# EAGLE design humidity (EAGLE 4.16)
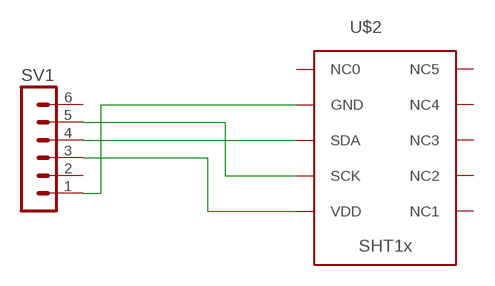
[diagram p0: schematic, sheet 1]

## Parts
SV1  MA06-1  [MA06-1]
U$2  SHT1X  [SHT1X]

## Nets
GND: SV1.1 U$2.P$2(GND)
SCK: SV1.5 U$2.P$4(SCK)
SDA: SV1.4 U$2.P$3(SDA)
VDD3_3: SV1.3 U$2.P$5(VDD)
Unconnected: SV1.2 SV1.6 U$2.P$1(NC0) U$2.P$6(NC1) U$2.P$7(NC2) U$2.P$8(NC3) U$2.P$9(NC4) U$2.P$10(NC5)

## Library data of the parts
SV1 = con-lstb:MA06-1: PIN HEADER
U$2 = Stofer:SHT1X: Sensiron Humidity sensor

## Board
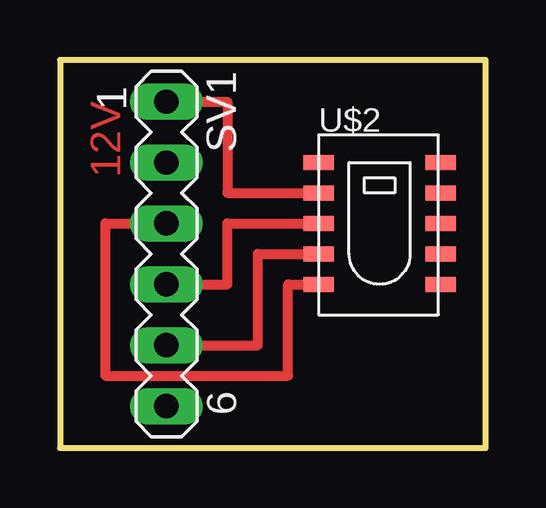
[diagram p1: board, top side]

Size 17.76 x 16.18 mm. Coordinates in mm from the lower left corner, seen from the top.
Outline: 0,0 17.76,0 17.76,16.18 0,16.18 0,0
Copper layers (1*2+15*16): Top 0.035mm / dielectric 0.2mm / Route2 0.035mm / dielectric 0.15mm / Route15 0.035mm / dielectric 0.2mm / Bottom 0.035mm
Design rules "default": minimum track width 10mil, minimum drill 24mil, track to track 8mil, track to pad 8mil, pad to pad 8mil, via to via 8mil, smd to smd 8mil, copper to edge 40mil, drill to drill 8mil, minimum pad ring 10mil, minimum via ring 8mil, stop-mask expansion 4mil, vias tented up to drill 0mil, thermal gap 10mil

### Footprints (pad centres in the part's own frame; a part is rotated, then mirrored left to right if it is on the bottom)
MA06-1 = drill 1.016 long: 1 -6.35,0; 2 -3.81,0; 3 -1.27,0; 4 1.27,0; 5 3.81,0; 6 6.35,0
SHT1X = smd 1.27 x 0.635: P$1 -2.54,2.54; P$2 -2.54,1.27; P$3 -2.54,0; P$4 -2.54,-1.27; P$5 -2.54,-2.54; P$6 2.54,-2.54; P$7 2.54,-1.27; P$8 2.54,0; P$9 2.54,1.27; P$10 2.54,2.54

### Placement (x,y rotation side)
SV1  4.44,8.09 270 top
U$2  13.33,9.36 0 top

### Tracks (layer width: path | path; a pad name or v marks a point on that pad's centre or on a via)
GND
  Top 0.406: SV1.1 6.98,14.44 6.98,10.63 U$2.P$2
SCK
  Top 0.406: SV1.5 8.25,4.28 8.25,8.09 U$2.P$4
SDA
  Top 0.406: SV1.4 6.98,6.82 6.98,9.36 U$2.P$3
VDD3_3
  Top 0.406: SV1.3 1.9,9.36 1.9,3.01 9.52,3.01 9.52,6.82 U$2.P$5

### Text on the board
Top: 12V